# EAGLE schematic SushiBitsCamera (EAGLE 7.6.0)

## Sheet 1 of 5
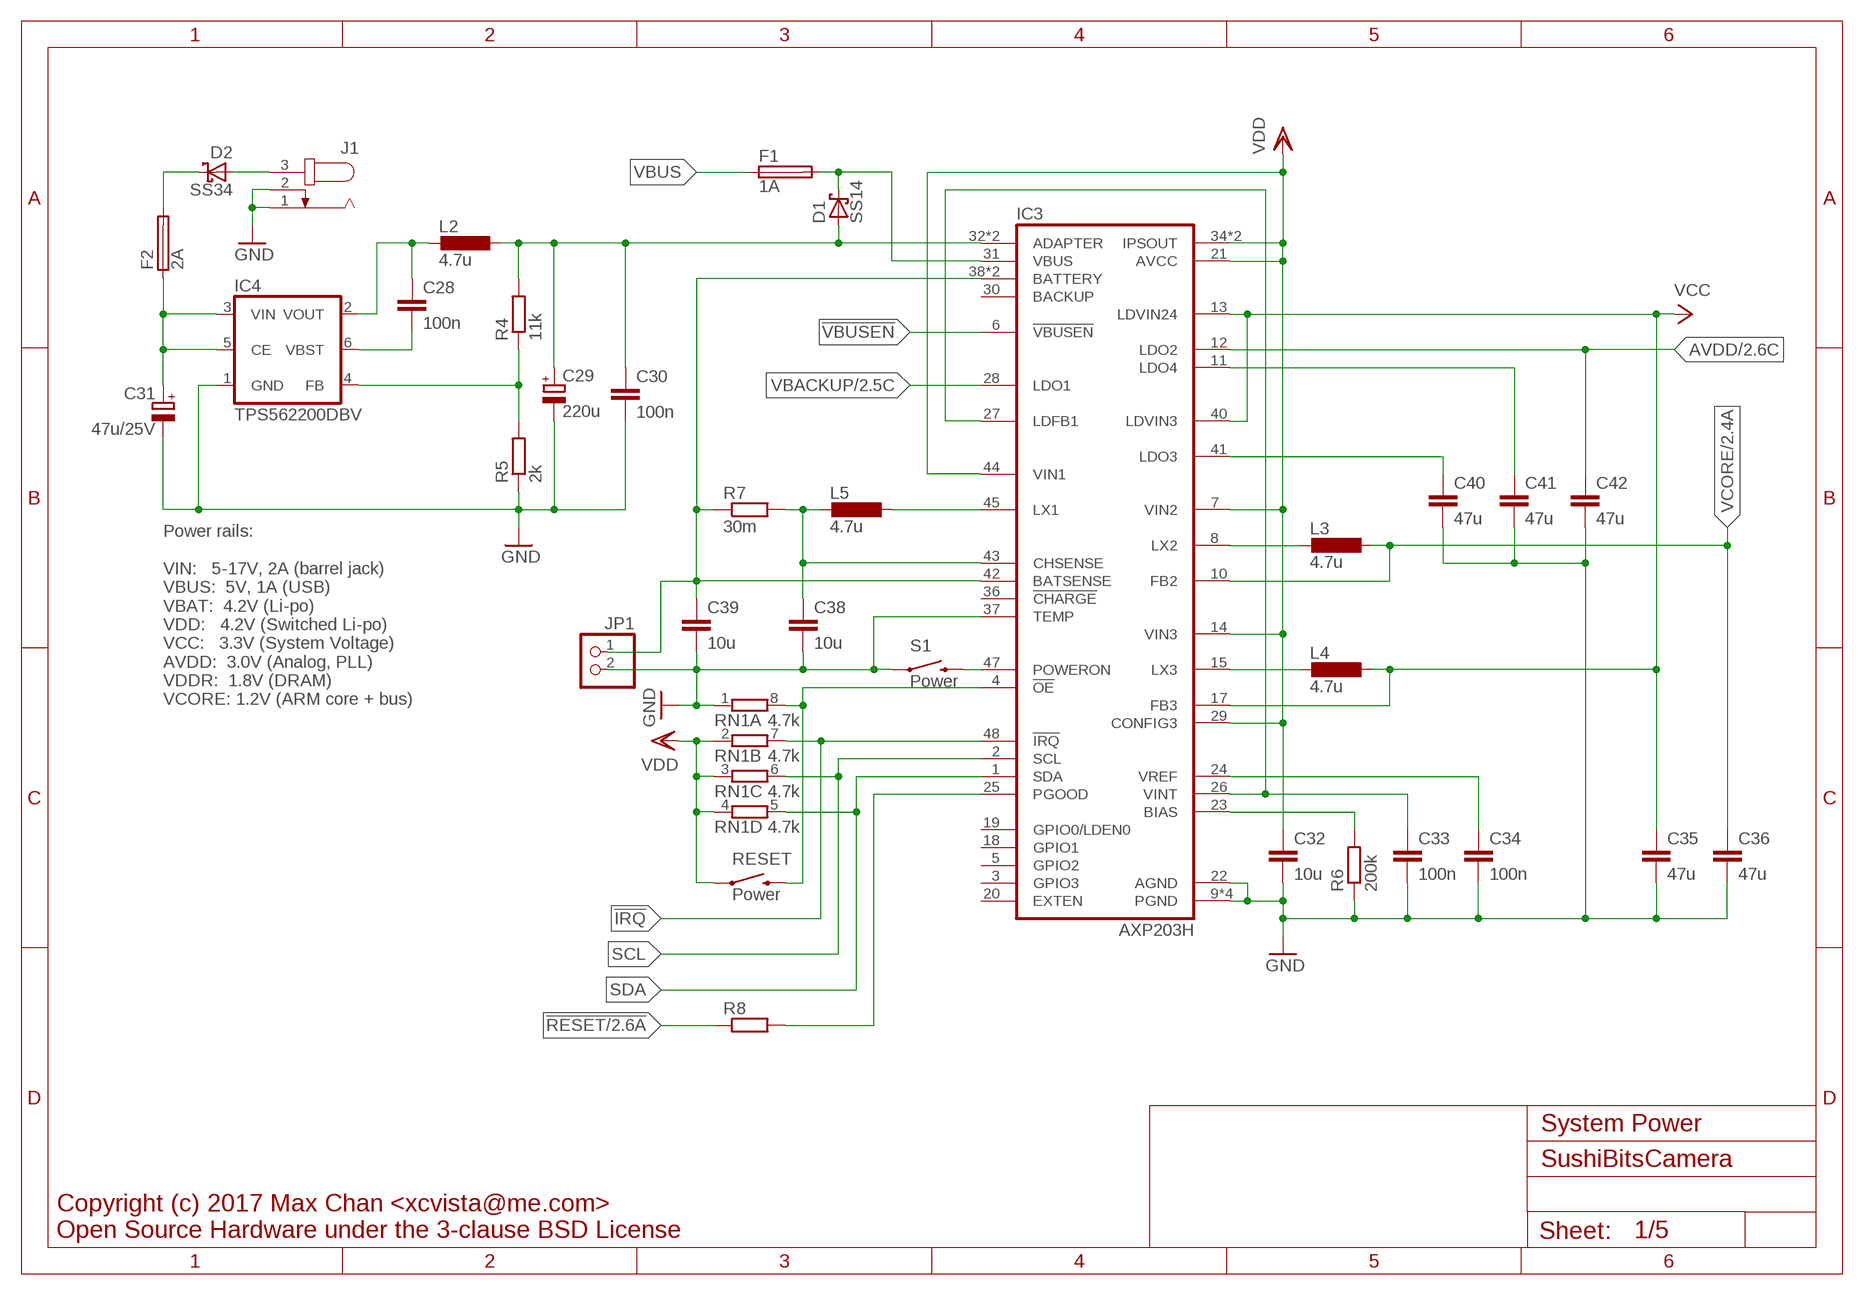
[diagram p0: schematic, sheet 1]

### Parts
C28  100n  C-EUC0603  [C0603]
C29  220u  CPOL-EUSMCB  [SMC_B]
C30  100n  C-EUC0603  [C0603]
C31  47u/25V  CPOL-EUSMCD  [SMC_D]
C32  10u  C-EUC0603  [C0603]
C33  100n  C-EUC0603  [C0603]
C34  100n  C-EUC0603  [C0603]
C35  47u  C-EUC1206  [C1206]
C36  47u  C-EUC1206  [C1206]
C38  10u  C-EUC0603  [C0603]
C39  10u  C-EUC0603  [C0603]
C40  47u  C-EUC1206  [C1206]
C41  47u  C-EUC1206  [C1206]
C42  47u  C-EUC1206  [C1206]
D1  SS14  SCHOTTKY-DIODEDO214AC  [DO214AC]
D2  SS34  SCHOTTKY-DIODEDO214AC  [DO214AC]
F1  1A  FUSER1206  [R1206]
F2  2A  FUSER1206  [R1206]
IC3  AXP203H  [QFN48-6X6-H]
IC4  TPS562200DBV  [SOT23-6L]
J1  JACK-PLUG0  [SPC4077]
JP1  PINHD-1X2  [1X02]
L2  4.7u  L-EUL5650M  [L5650M]
L3  4.7u  L-EUL5650M  [L5650M]
L4  4.7u  L-EUL5650M  [L5650M]
L5  4.7u  L-EUL5650M  [L5650M]
R4  11k  R-EU_R0603  [R0603]
R5  2k  R-EU_R0603  [R0603]
R6  200k  R-EU_R0603  [R0603]
R7  30m  R-EU_R2512  [R2512]
R8  R-EU_R0603  [R0603]
RESET  Power  SWITCH-MOMENTARY-2SIDE_EZ  [TACTILE-PTH-SIDEEZ]
RN1  4.7k  4R-NEXB38V  [EXB38V]
S1  Power  SWITCH-MOMENTARY-2SIDE_EZ  [TACTILE-PTH-SIDEEZ]

### Nets
!IRQ: IC3.48(!IRQ) RN1.7
!RESET: R8.1 ; also sheet 2
!VBUSEN: IC3.6(!VBUSEN)
AVDD: C42.1 IC3.12(LDO2) ; also sheet 2
GND: C29.- C30.2 C31.- C32.2 C33.2 C34.2 C35.2 C36.2 C38.2 C39.2 C40.2 C41.2 C42.2 IC3.9(PGND) IC3.16(PGND) IC3.22(AGND) IC3.37(TEMP) IC3.46(PGND) IC3.P(PGND) IC4.1(GND) J1.1 J1.2 JP1.2 R5.1 R6.1 RN1.1 S1.1 ; also sheet 2,3
N$9: D1.C F1.2 IC3.31(VBUS)
N$10: C29.+ C30.1 D1.A IC3.32(ADAPTER) IC3.33(ADAPTER) L2.1 R4.2
N$11: C28.1 IC4.2(VOUT) L2.2
N$12: C28.2 IC4.6(VBST)
N$13: IC4.4(FB) R4.1 R5.2
N$14: C31.+ F2.1 IC4.3(VIN) IC4.5(CE)
N$15: C38.1 IC3.43(CHSENSE) L5.2 R7.2
N$16: IC3.23(BIAS) R6.2
N$17: C33.1 IC3.26(VINT) IC3.27(LDFB1)
N$18: C34.1 IC3.24(VREF)
N$19: IC3.45(LX1) L5.1
N$20: C39.1 IC3.38(BATTERY) IC3.39(BATTERY) IC3.42(BATSENSE) JP1.1 R7.1
N$21: IC3.8(LX2) L3.2
N$22: IC3.15(LX3) L4.2
N$23: IC3.47(POWERON) S1.2
N$24: IC3.4(!OE) RESET.2 RN1.8
N$25: C40.1 IC3.41(LDO3)
N$26: C41.1 IC3.11(LDO4)
N$27: D2.A J1.3
N$28: D2.C F2.2
N$30: IC3.25(PGOOD) R8.2
SCL: IC3.2(SCL) RN1.6
SDA: IC3.1(SDA) RN1.5
VBACKUP: IC3.28(LDO1) ; also sheet 2
VBUS: F1.1
VCC: C35.1 IC3.13(LDVIN24) IC3.17(FB3) IC3.40(LDVIN3) L4.1 ; also sheet 2,3
VCORE: C36.1 IC3.10(FB2) L3.1 ; also sheet 2
VDD: C32.1 IC3.7(VIN2) IC3.14(VIN3) IC3.21(AVCC) IC3.29(CONFIG3) IC3.34(IPSOUT) IC3.35(IPSOUT) IC3.44(VIN1) RESET.1 RN1.2 RN1.3 RN1.4 ; also sheet 2
Unconnected: IC3.3(GPIO3) IC3.5(GPIO2) IC3.18(GPIO1) IC3.19(GPIO0/LDEN0) IC3.20(EXTEN) IC3.30(BACKUP) IC3.36(!CHARGE)

### Notes on the sheet
- Power rails:
  
  VIN:   5-17V, 2A (barrel jack)
  VBUS:  5V, 1A (USB)
  VBAT:  4.2V (Li-po)
  VDD:   4.2V (Switched Li-po)
  VCC:   3.3V (System Voltage)
  AVDD:  3.0V (Analog, PLL)
  VDDR:  1.8V (DRAM)
  VCORE: 1.2V (ARM core + bus)
- System Power
- Copyright (c) 2017 Max Chan <xcvista@me.com>
  Open Source Hardware under the 3-clause BSD License

## Sheet 2 of 5
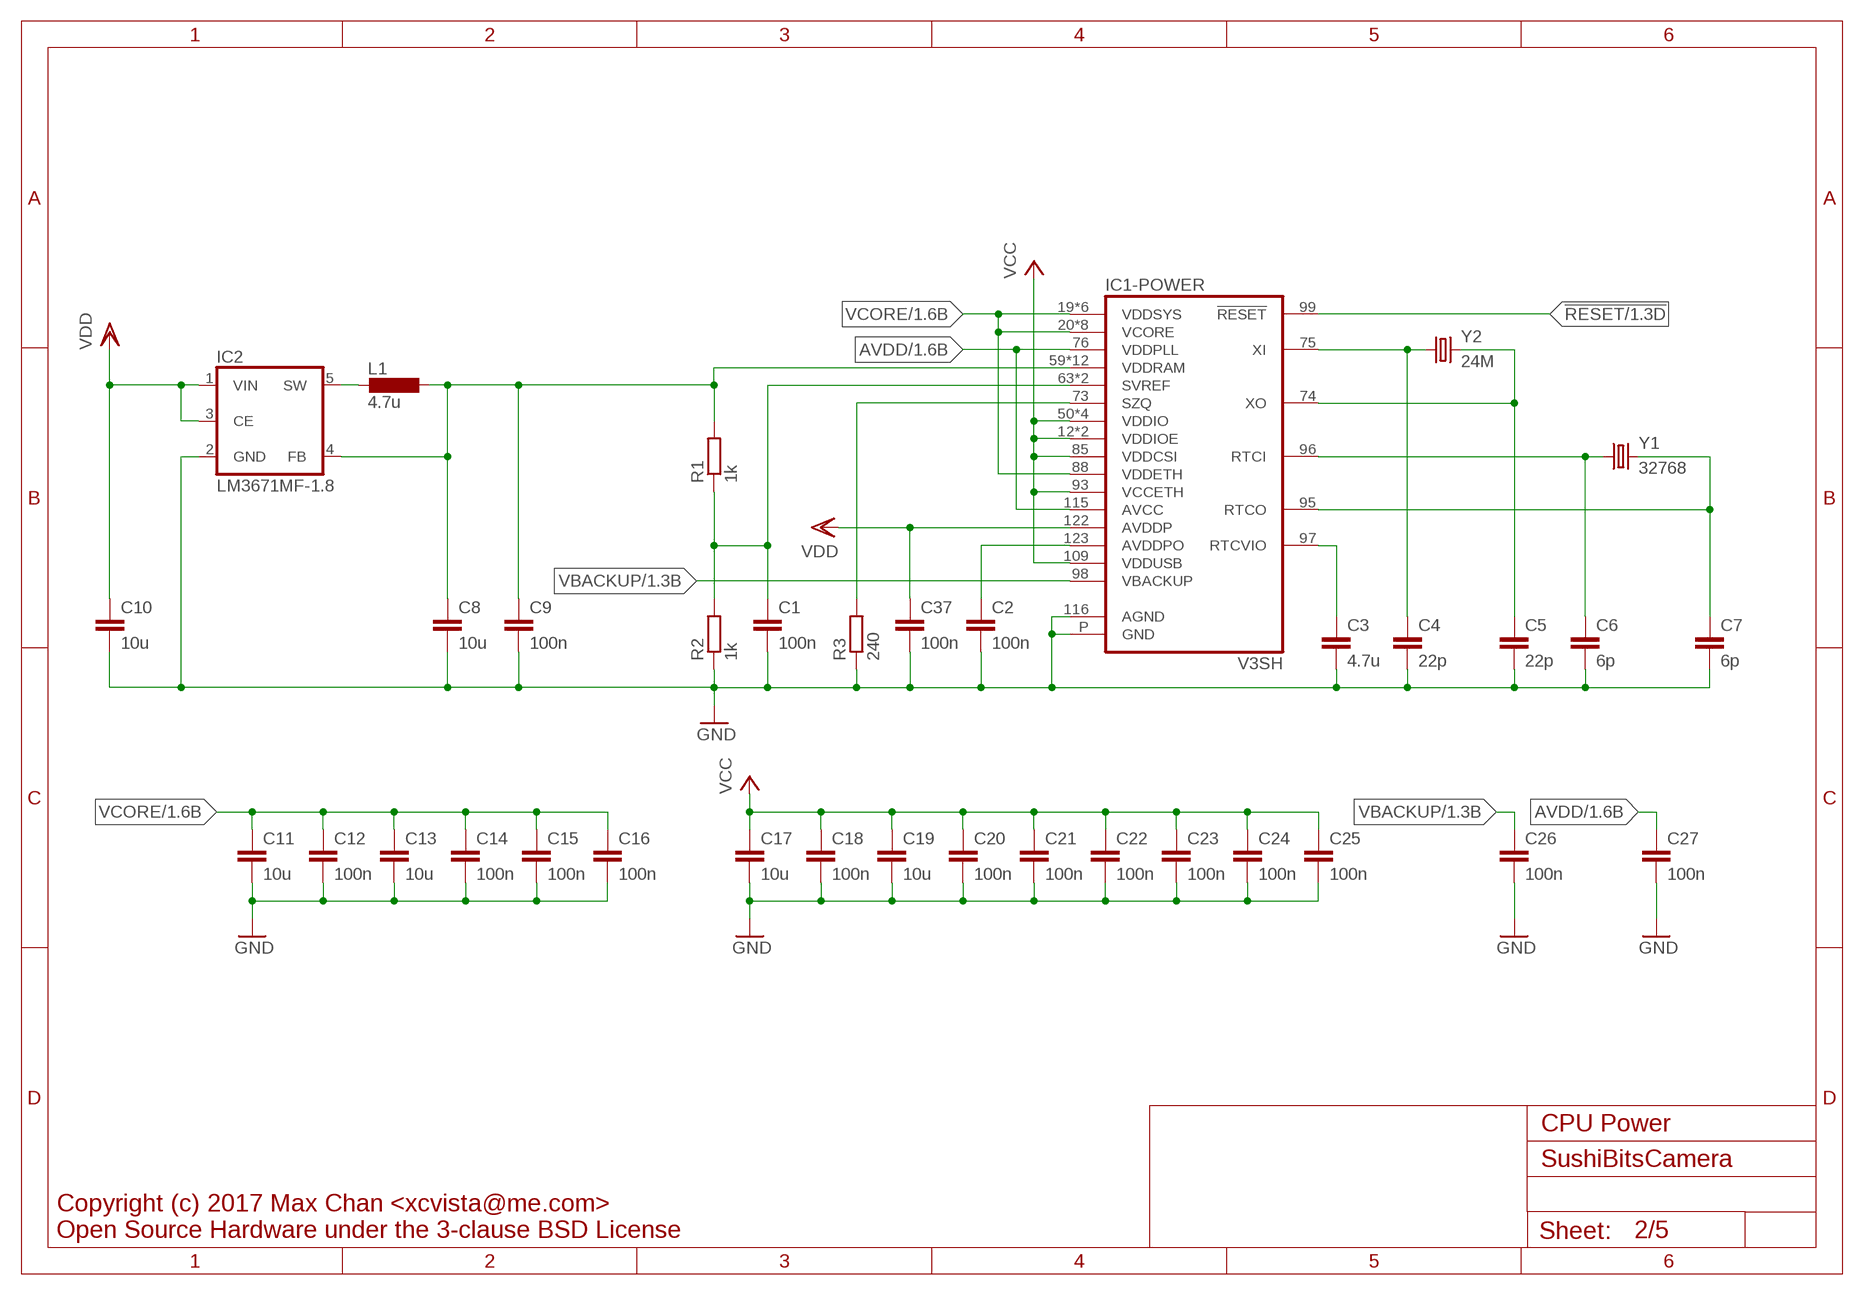
[diagram p1: schematic, sheet 2]

### Parts
C1  100n  C-EUC0603  [C0603]
C2  100n  C-EUC0603  [C0603]
C3  4.7u  C-EUC0603  [C0603]
C4  22p  C-EUC0603  [C0603]
C5  22p  C-EUC0603  [C0603]
C6  6p  C-EUC0603  [C0603]
C7  6p  C-EUC0603  [C0603]
C8  10u  C-EUC0603  [C0603]
C9  100n  C-EUC0603  [C0603]
C10  10u  C-EUC0603  [C0603]
C11  10u  C-EUC0603  [C0603]
C12  100n  C-EUC0603  [C0603]
C13  10u  C-EUC0603  [C0603]
C14  100n  C-EUC0603  [C0603]
C15  100n  C-EUC0603  [C0603]
C16  100n  C-EUC0603  [C0603]
C17  10u  C-EUC0603  [C0603]
C18  100n  C-EUC0603  [C0603]
C19  10u  C-EUC0603  [C0603]
C20  100n  C-EUC0603  [C0603]
C21  100n  C-EUC0603  [C0603]
C22  100n  C-EUC0603  [C0603]
C23  100n  C-EUC0603  [C0603]
C24  100n  C-EUC0603  [C0603]
C25  100n  C-EUC0603  [C0603]
C26  100n  C-EUC0603  [C0603]
C27  100n  C-EUC0603  [C0603]
C37  100n  C-EUC0603  [C0603]
IC1  V3SH  [ELQFP128-H]
IC2  LM3671MF-1.8  [SOT23-5L]
L1  4.7u  L-EUL5650M  [L5650M]
R1  1k  R-EU_R0603  [R0603]
R2  1k  R-EU_R0603  [R0603]
R3  240  R-EU_R0603  [R0603]
Y1  32768  CRYSTAL3.2X1.5MM  [CRYSTAL-SMD-3.2X1.5MM]
Y2  24M  CRYSTALCRYSTAL-SMD-5X3-16MHZ  [CRYSTAL-SMD-5X3]

### Nets
!RESET: IC1.99(-POWER:!RESET) ; also sheet 1
AVDD: C27.1 IC1.76(-POWER:VDDPLL) IC1.115(-POWER:AVCC) ; also sheet 1
GND: C1.2 C2.2 C3.2 C4.2 C5.2 C6.2 C7.2 C8.2 C9.2 C10.2 C11.2 C12.2 C13.2 C14.2 C15.2 C16.2 C17.2 C18.2 C19.2 C20.2 C21.2 C22.2 C23.2 C24.2 C25.2 C26.2 C27.2 C37.2 IC1.116(-POWER:AGND) IC1.P(-POWER:GND) IC2.2(GND) R2.1 R3.1 ; also sheet 1,3
N$1: C2.1 IC1.123(-POWER:AVDDPO)
N$2: IC1.73(-POWER:SZQ) R3.2
N$3: C4.1 IC1.75(-POWER:XI) Y2.1
N$4: C5.1 IC1.74(-POWER:XO) Y2.3
N$5: C6.1 IC1.96(-POWER:RTCI) Y1.P$1
N$6: C7.1 IC1.95(-POWER:RTCO) Y1.P$2
N$7: C3.1 IC1.97(-POWER:RTCVIO)
N$8: IC2.5(SW) L1.2
SVREF: C1.1 IC1.63(-POWER:SVREF) IC1.71(-POWER:SVREF) R1.1 R2.2
VBACKUP: C26.1 IC1.98(-POWER:VBACKUP) ; also sheet 1
VCC: C17.1 C18.1 C19.1 C20.1 C21.1 C22.1 C23.1 C24.1 C25.1 IC1.12(-POWER:VDDIOE) IC1.29(-POWER:VDDIOE) IC1.50(-POWER:VDDIO) IC1.57(-POWER:VDDIO) IC1.85(-POWER:VDDCSI) IC1.93(-POWER:VCCETH) IC1.104(-POWER:VDDIO) IC1.109(-POWER:VDDUSB) IC1.127(-POWER:VDDIO) ; also sheet 1,3
VCORE: C11.1 C12.1 C13.1 C14.1 C15.1 C16.1 IC1.19(-POWER:VDDSYS) IC1.20(-POWER:VCORE) IC1.21(-POWER:VCORE) IC1.25(-POWER:VCORE) IC1.26(-POWER:VCORE) IC1.38(-POWER:VCORE) IC1.47(-POWER:VCORE) IC1.51(-POWER:VCORE) IC1.56(-POWER:VCORE) IC1.58(-POWER:VDDSYS) IC1.64(-POWER:VDDSYS) IC1.80(-POWER:VDDSYS) IC1.88(-POWER:VDDETH) IC1.108(-POWER:VDDSYS) IC1.126(-POWER:VDDSYS) ; also sheet 1
VDD: C10.1 C37.1 IC1.122(-POWER:AVDDP) IC2.1(VIN) IC2.3(CE) ; also sheet 1
VDDRAM: C8.1 C9.1 IC1.59(-POWER:VDDRAM) IC1.60(-POWER:VDDRAM) IC1.61(-POWER:VDDRAM) IC1.62(-POWER:VDDRAM) IC1.65(-POWER:VDDRAM) IC1.66(-POWER:VDDRAM) IC1.67(-POWER:VDDRAM) IC1.68(-POWER:VDDRAM) IC1.69(-POWER:VDDRAM) IC1.70(-POWER:VDDRAM) IC1.72(-POWER:VDDRAM) IC1.79(-POWER:VDDRAM) IC2.4(FB) L1.1 R1.2
Unconnected: IC1.6(-PORTE:PE24/LCD_D23/CTS1) IC1.7(-PORTE:PE23/LCD_D22/RTS1) IC1.8(-PORTE:PE22/CSI_SDA/SDA1/RX1) IC1.9(-PORTE:PE21/CSI_SCL/SCL1/TX1) IC1.10(-PORTE:PE20/CSI_FIELD/CSI_MIPI_MCLK) IC1.11(-PORTE:PE19/CSI_D15/LCD_D21) IC1.13(-PORTE:PE18/CSI_D14/LCD_D20) IC1.14(-PORTE:PE17/CSI_D13/LCD_D19) IC1.15(-PORTE:PE16/CSI_D12/LCD_D18) IC1.16(-PORTE:PE15/CSI_D11/LCD_D15) IC1.17(-PORTE:PE14/CSI_D10/LCD_D14) IC1.18(-PORTE:PE13/CSI_D9/LCD_D13) IC1.22(-PORTE:PE12/CSI_D8/LCD_D12) IC1.23(-PORTE:PE11/CSI_D7/LCD_D11) IC1.24(-PORTE:PE10/CSI_D6/LCD_D10) IC1.27(-PORTE:PE9/CSI_D5/LCD_D7) IC1.28(-PORTE:PE8/CSI_D4/LCD_D6) IC1.30(-PORTE:PE7/CSI_D3/LCD_D5) IC1.31(-PORTE:PE6/CSI_D2/LCD_D4) IC1.32(-PORTE:PE5/CSI_D1/LCD_D3) IC1.33(-PORTE:PE4/CST_D0/LCD_D2) IC1.34(-PORTE:PE3/CSI_VSYNC/LCD_VSYNC) IC1.35(-PORTE:PE2/CSI_HSYNC/LCD_HSYNC) IC1.36(-PORTE:PE1/CSI_MCLK/LCD_ME) IC1.37(-PORTE:PE0/CSI_PCLK/LCD_CLK) IC1.39(-PORTBC:PB0/TX2) IC1.40(-PORTBC:PB1/RX2) IC1.41(-PORTBC:PB2/RTS2) IC1.42(-PORTBC:PB3/CTS2) IC1.43(-PORTBC:PB4/PWM0) IC1.44(-PORTBC:PB5/PWM1) IC1.45(-PORTBC:PB6/SCL0) IC1.46(-PORTBC:PB7/SDA0) IC1.48(-PORTBC:PB8/SCL1/TX0) IC1.49(-PORTBC:PB9/SDA1/RX0) IC1.52(-PORTBC:PC0/SD2_CLK/MISO0) IC1.53(-PORTBC:PC1/SD2_CMD/SCK0) IC1.54(-PORTBC:PC2/SD2_RST/SPICS0) IC1.55(-PORTBC:PC3/SD2_D0/MOSI0) IC1.77(-MISC:ETH_LINK) IC1.78(-MISC:ETH_SPEED) IC1.81(-MISC:CSI_D0+) IC1.82(-MISC:CSI_D0-) IC1.83(-MISC:CSI_D1+) IC1.84(-MISC:CSI_D1-) IC1.86(-MISC:CSI_CLK+) IC1.87(-MISC:CSI_CLK-) IC1.89(-MISC:ETH_RX-) IC1.90(-MISC:ETH_RX+) IC1.91(-MISC:ETH_TX-) IC1.92(-MISC:ETH_TX+) IC1.94(-MISC:ETH_RTX) IC1.110(-MISC:USB_D-) IC1.111(-MISC:USB_D+) IC1.112(-MISC:LRADC) IC1.113(-AUDIO:MIC+) IC1.114(-AUDIO:MIC-) IC1.117(-AUDIO:VREF) IC1.118(-AUDIO:VREF) IC1.119(-AUDIO:HBIAS) IC1.120(-AUDIO:AOUTR) IC1.121(-AUDIO:AOUTL) IC1.124(-AUDIO:HPCOMFB) IC1.125(-AUDIO:HPCOM)

### Notes on the sheet
- CPU Power
- Copyright (c) 2017 Max Chan <xcvista@me.com>
  Open Source Hardware under the 3-clause BSD License

## Sheet 3 of 5
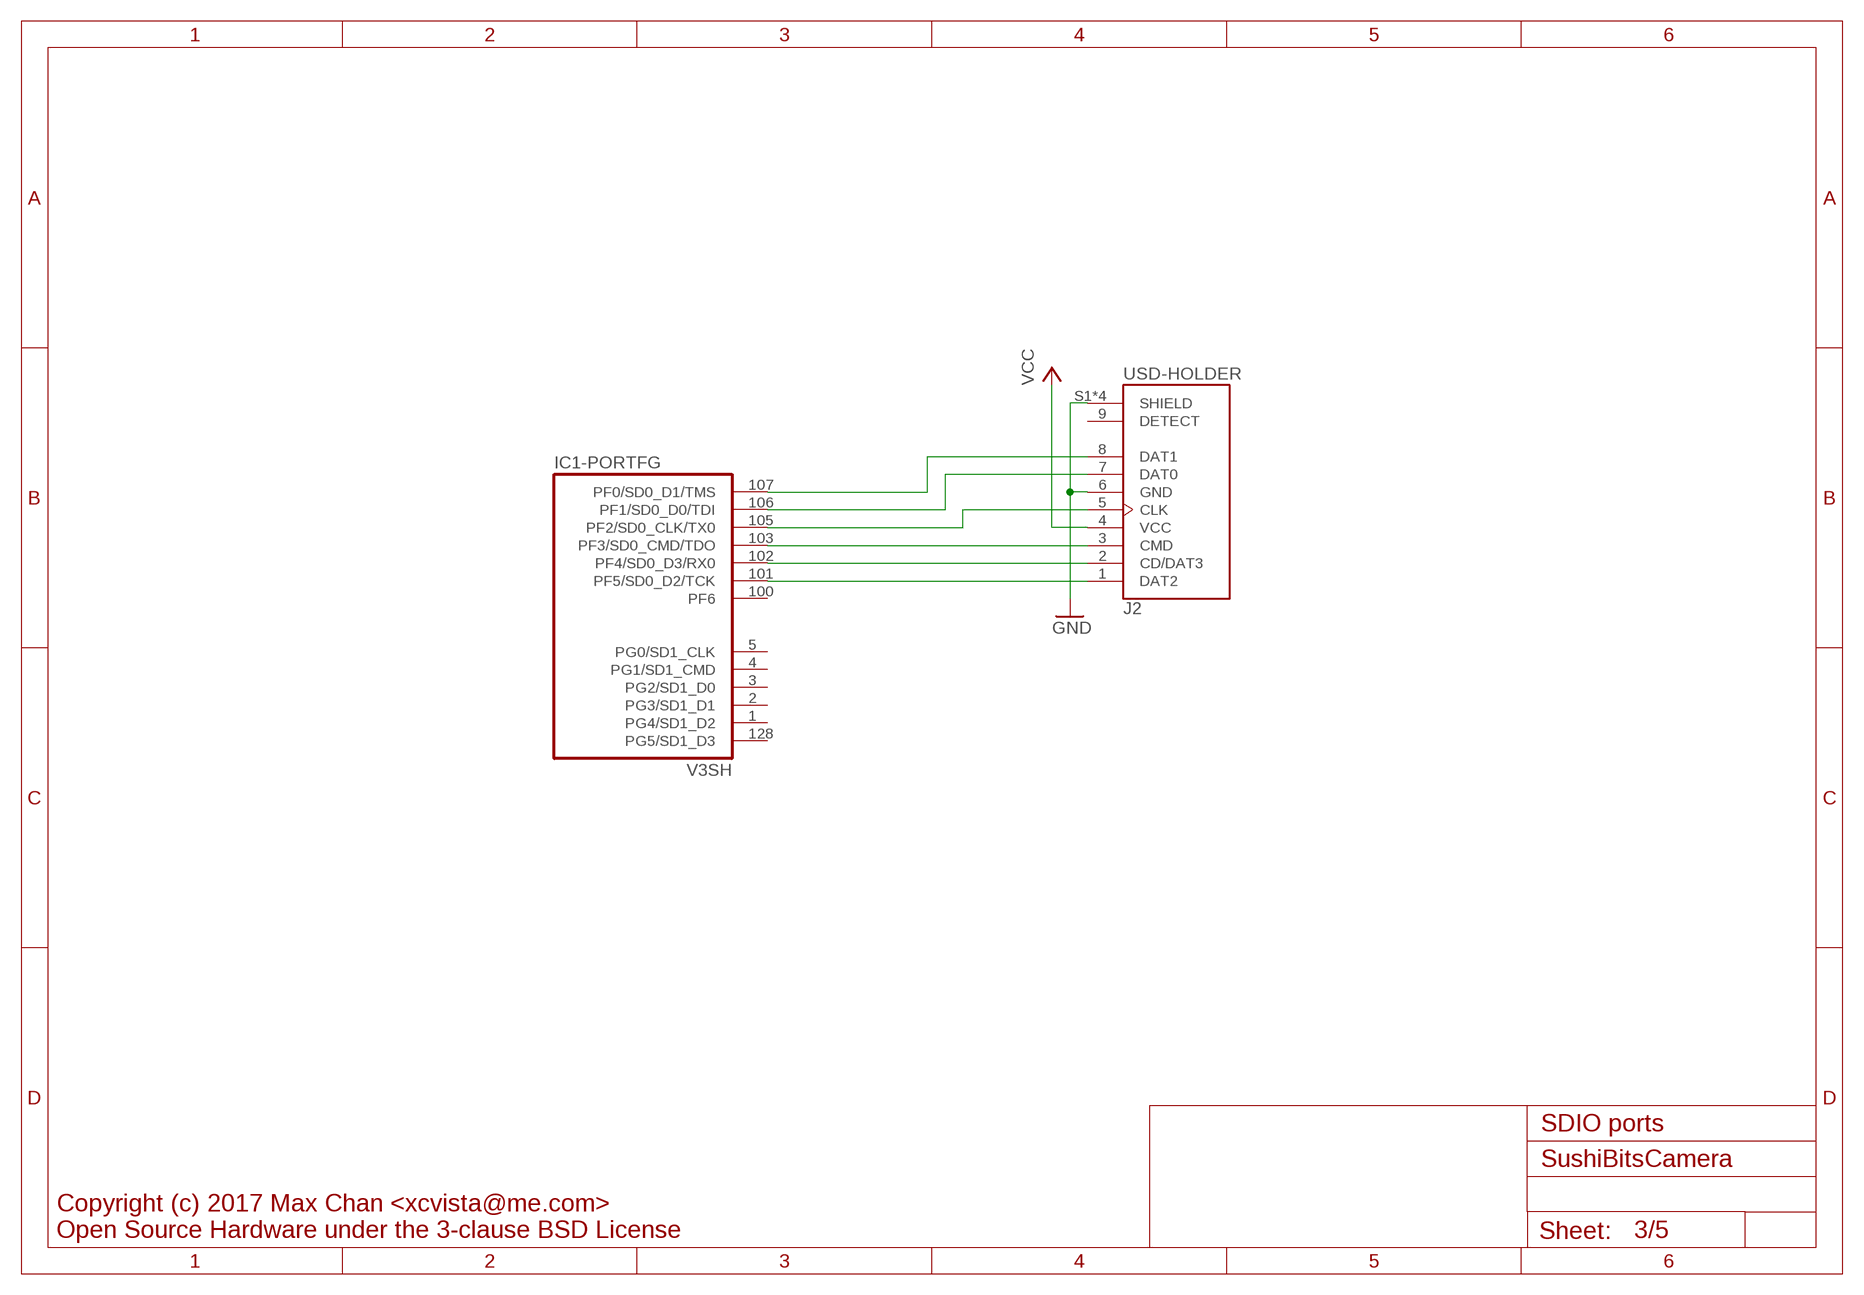
[diagram p2: schematic, sheet 3]

### Parts
J2  USD-HOLDER  [USD-HOLDER]

### Nets
GND: J2.6(GND) J2.S1(SHIELD) J2.S2(SHIELD) J2.S3(SHIELD) J2.S4(SHIELD) ; also sheet 1,2
N$29: IC1.101(-PORTFG:PF5/SD0_D2/TCK) J2.1(DAT2)
N$31: IC1.102(-PORTFG:PF4/SD0_D3/RX0) J2.2(CD/DAT3)
N$32: IC1.103(-PORTFG:PF3/SD0_CMD/TDO) J2.3(CMD)
N$33: IC1.105(-PORTFG:PF2/SD0_CLK/TX0) J2.5(CLK)
N$34: IC1.106(-PORTFG:PF1/SD0_D0/TDI) J2.7(DAT0)
N$35: IC1.107(-PORTFG:PF0/SD0_D1/TMS) J2.8(DAT1)
VCC: J2.4(VCC) ; also sheet 1,2
Unconnected: IC1.1(-PORTFG:PG4/SD1_D2) IC1.2(-PORTFG:PG3/SD1_D1) IC1.3(-PORTFG:PG2/SD1_D0) IC1.4(-PORTFG:PG1/SD1_CMD) IC1.5(-PORTFG:PG0/SD1_CLK) IC1.100(-PORTFG:PF6) IC1.128(-PORTFG:PG5/SD1_D3) J2.9(DETECT)

### Notes on the sheet
- SDIO ports
- Copyright (c) 2017 Max Chan <xcvista@me.com>
  Open Source Hardware under the 3-clause BSD License

## Sheet 4 of 5
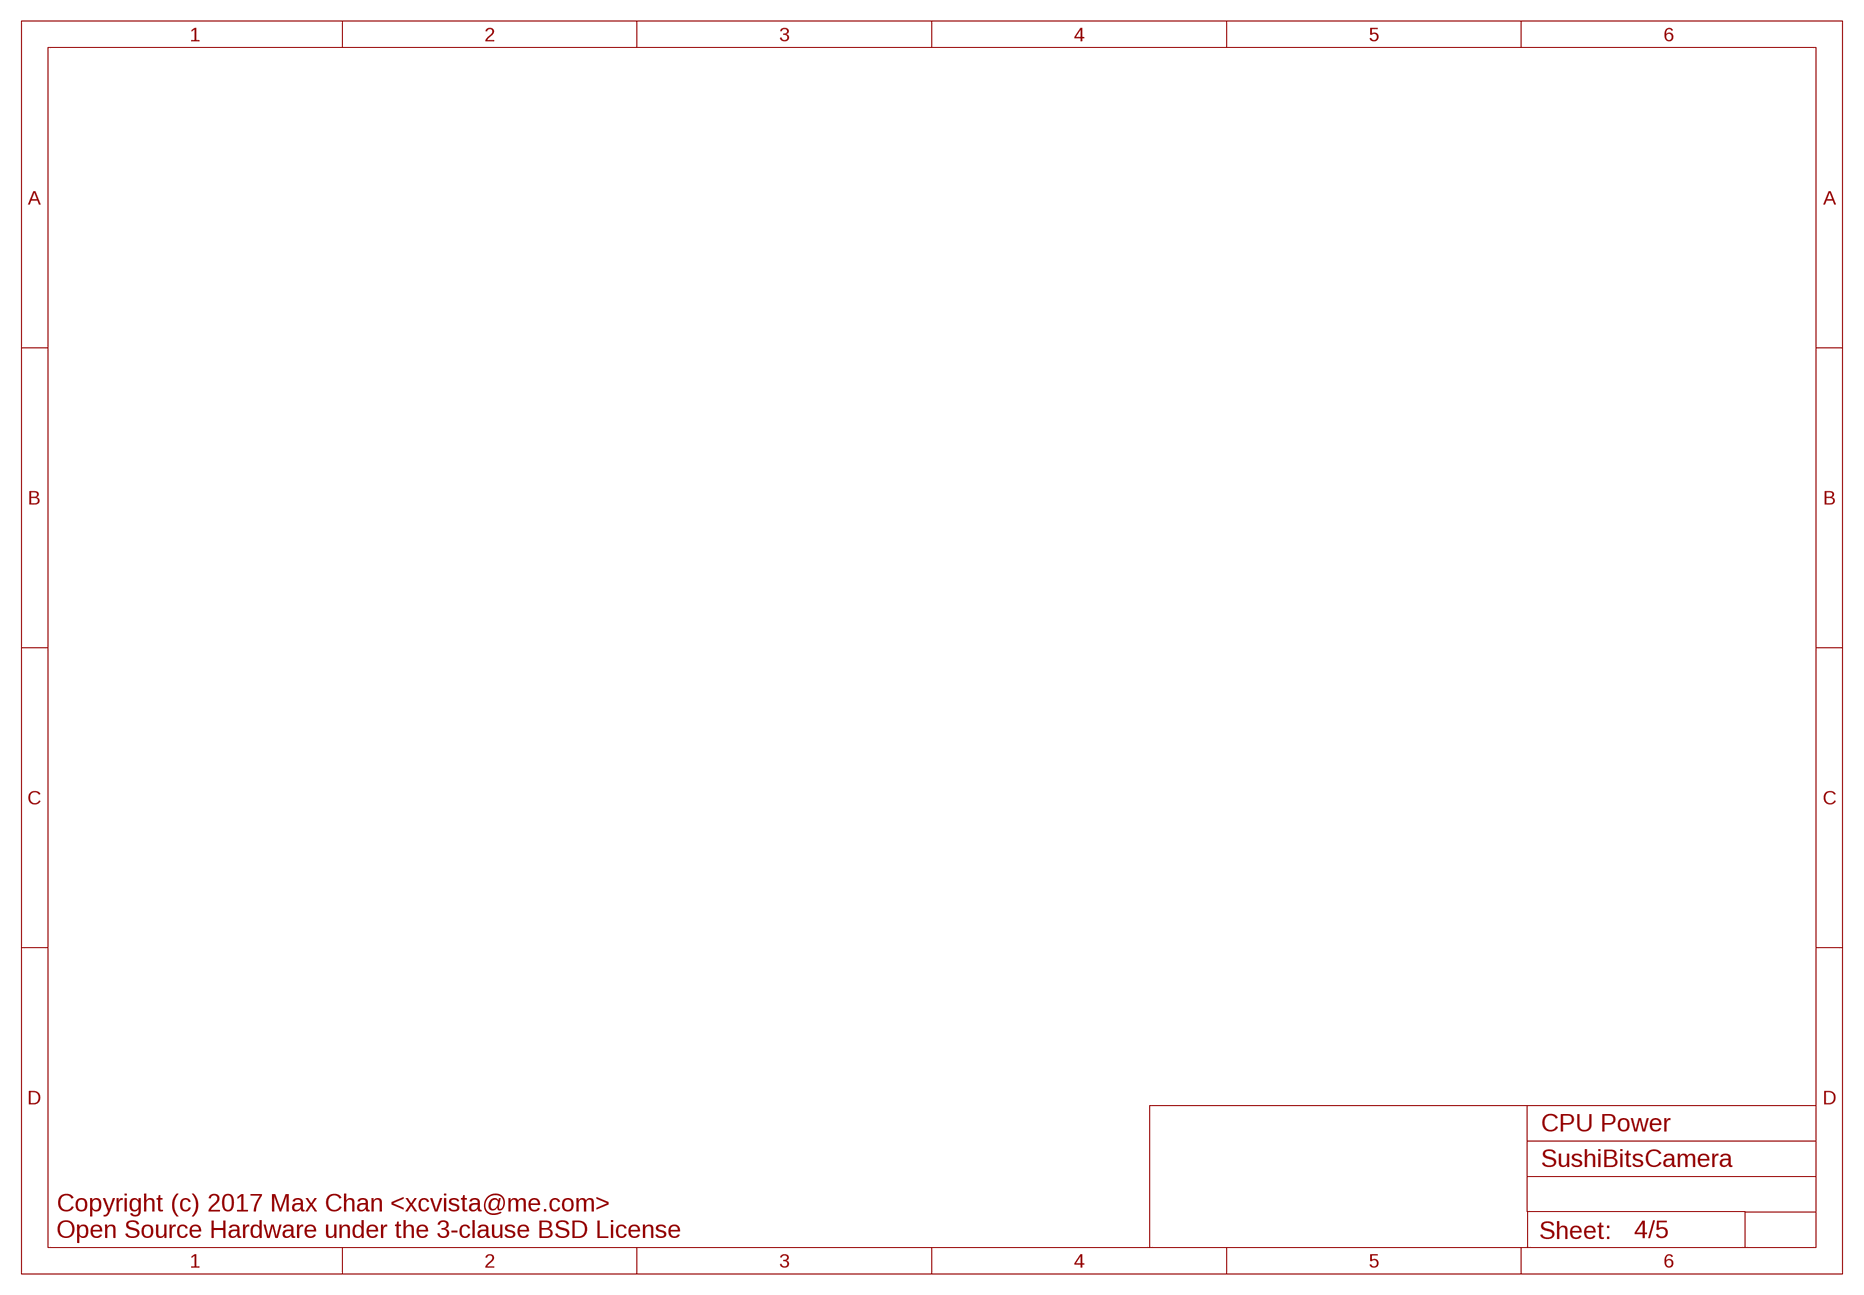
[diagram p3: schematic, sheet 4]

### Notes on the sheet
- CPU Power
- Copyright (c) 2017 Max Chan <xcvista@me.com>
  Open Source Hardware under the 3-clause BSD License

## Sheet 5 of 5
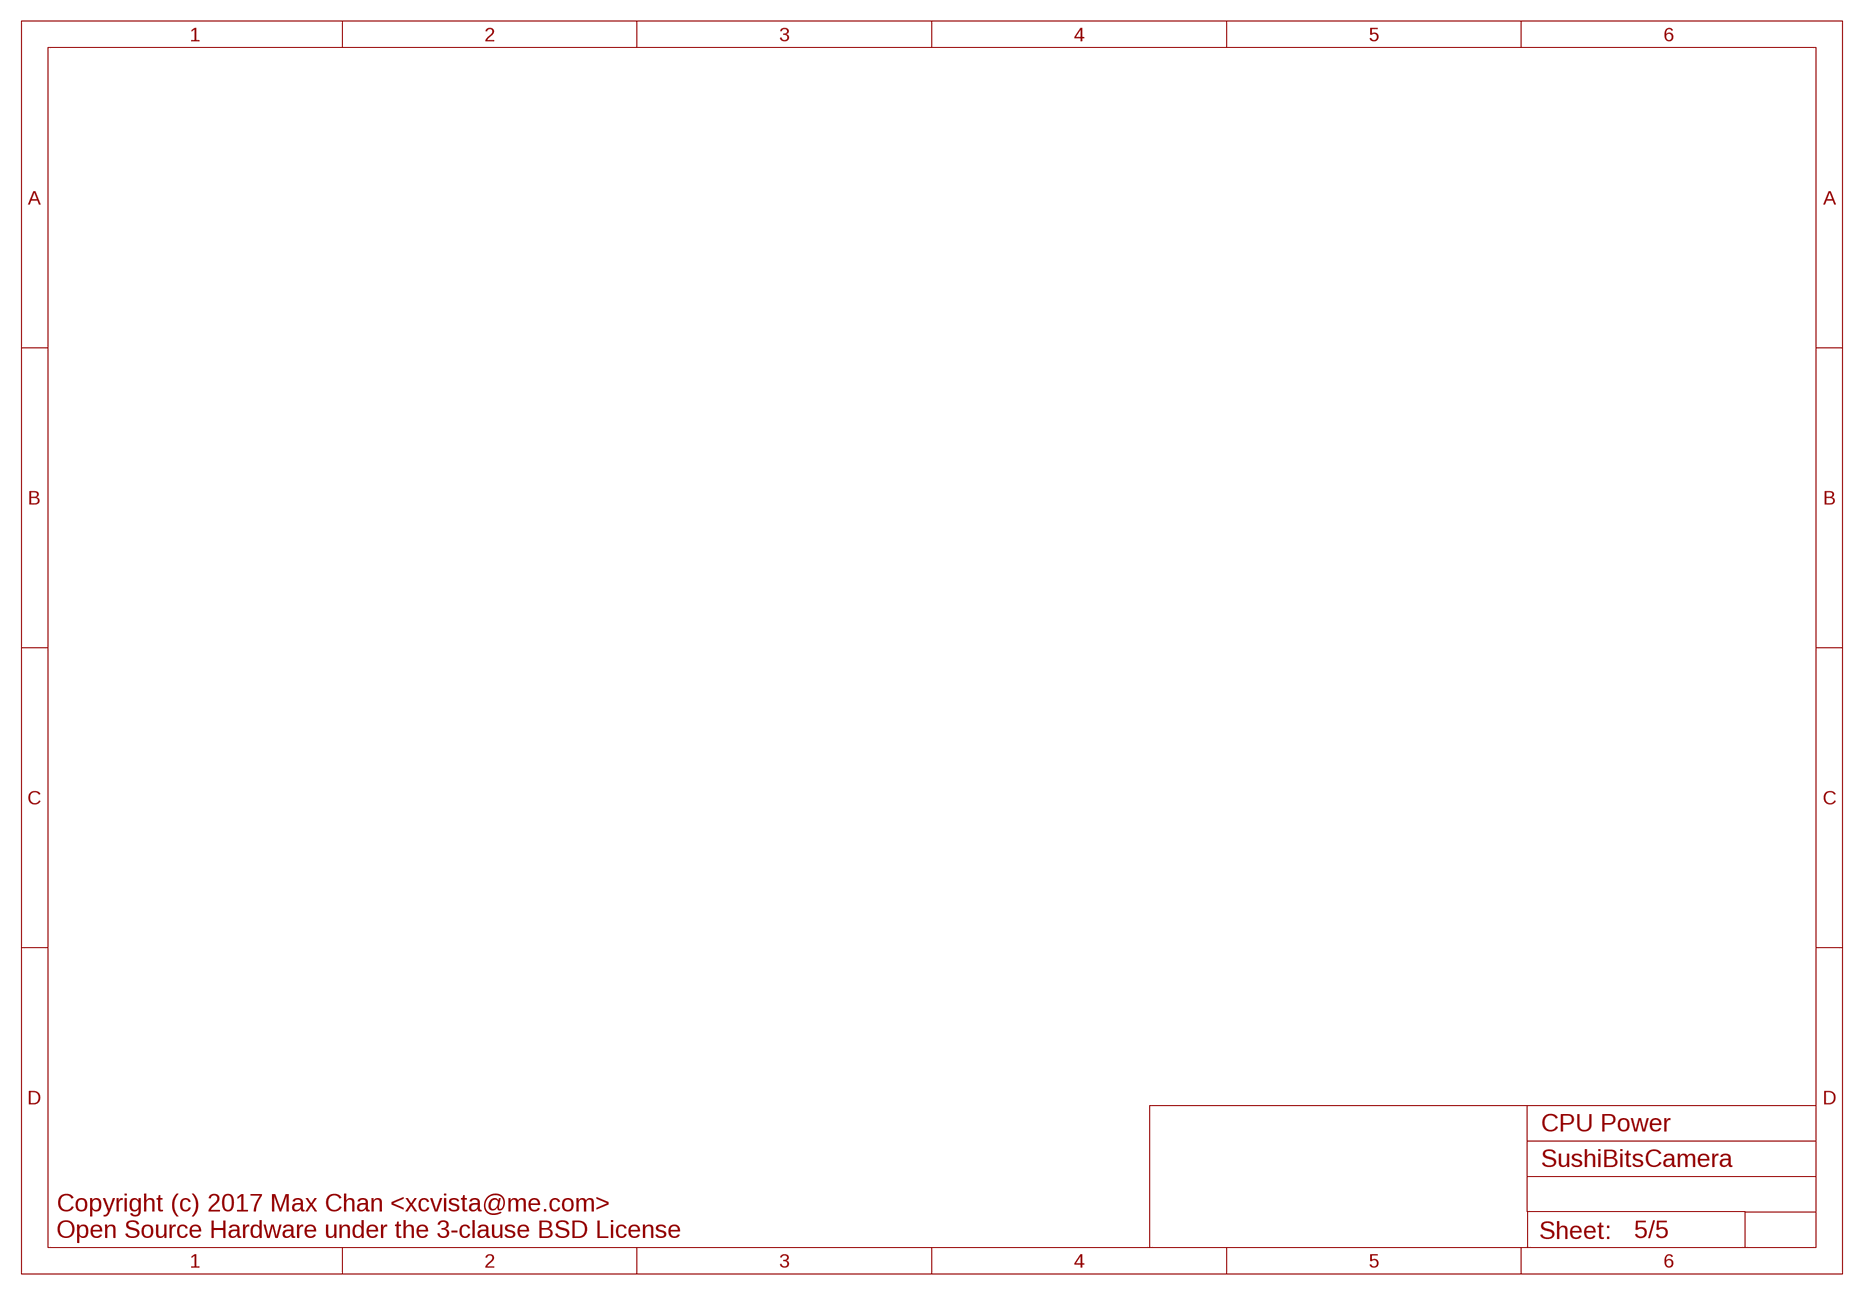
[diagram p4: schematic, sheet 5]

### Notes on the sheet
- CPU Power
- Copyright (c) 2017 Max Chan <xcvista@me.com>
  Open Source Hardware under the 3-clause BSD License

## Library data of the parts
C1-C28 C30 C32-C42 = rcl:C-EU: CAPACITOR, European symbol
C29 C31 = rcl:CPOL-EU: POLARIZED CAPACITOR, European symbol
D1 D2 = diode:SCHOTTKY-DIODE: Schottky Diode
F1 F2 = fuse:FUSE: Fuse
IC1 = AllWinner V3s:V3S
IC2 = AllWinner V3s:LM3671?: Integrated Switch Synchronous Buck Converter
IC3 = AllWinner V3s:AXP203
IC4 = AllWinner V3s:TPS56*200
J1 = con-jack:JACK-PLUG: DC POWER JACK Power Jack, DC, Right Angle, Through Hole, Rated 5A at 16VDC, PC Terminals Distributor: Farnell (www.Farnell.de) Drawing: 84N1161.pdf / 84N1162.pdf Manufacturer: SPC Technology (www.spctechnology.com) Type: SPC4077 / SPC 4078; OC_FARNELL: unknown; OC_NEWARK: unknown
J2 = AllWinner V3s:USD-HOLDER
JP1 = pinhead:PINHD-1X2: PIN HEADER
L1-L5 = rcl:L-EU: INDUCTOR, European symbol
R1-R8 = rcl:R-EU_: RESISTOR, European symbol
RESET S1 = SparkFun-Electromechanical:SWITCH-MOMENTARY-2: Various NO switches- pushbuttons, reed, etc
RN1 = resistor-dil:4R-N: Array Chip Resistor Source: RS Component / Phycomp; OC_FARNELL: unknown; OC_NEWARK: unknown
Y1 = SparkFun-FreqCtrl:CRYSTAL: Various standard crystals. Proven footprints.; PROD_ID: XTAL-13062; VALUE: 32.768kHz
Y2 = SparkFun-FreqCtrl:CRYSTAL: Various standard crystals. Proven footprints.; PROD_ID: XTAL-08218